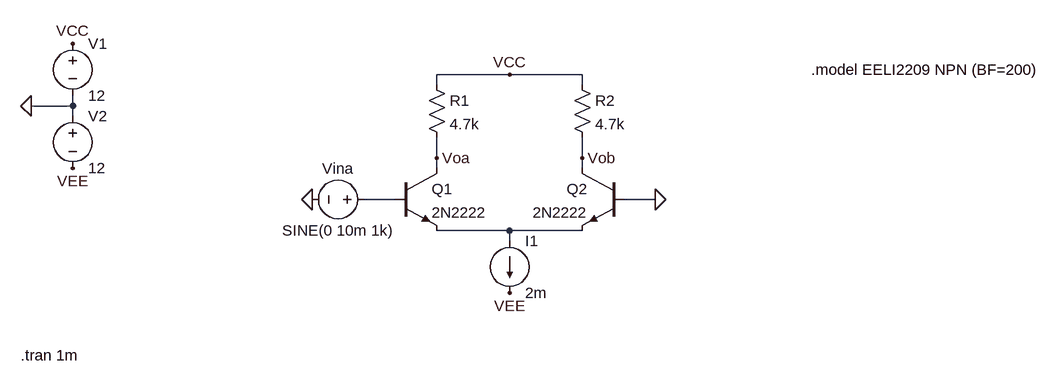
[diagram p0: schematic Draft2.asc]
Draft2.asc, the LTspice schematic file:
Version 4
SHEET 1 1432 680
WIRE 592 112 480 112
WIRE 704 112 592 112
WIRE 480 128 480 112
WIRE 704 128 704 112
WIRE -80 160 -80 144
WIRE -80 160 -144 160
WIRE -80 176 -80 160
WIRE 480 240 480 208
WIRE 704 240 704 208
WIRE 480 256 480 240
WIRE 704 256 704 240
WIRE 416 304 368 304
WIRE 816 304 768 304
WIRE 592 352 480 352
WIRE 704 352 592 352
WIRE 592 368 592 352
FLAG -80 256 VEE
FLAG -80 64 VCC
FLAG -144 160 0
FLAG 592 448 VEE
FLAG 592 112 VCC
FLAG 288 304 0
FLAG 704 240 Vob
FLAG 480 240 Voa
FLAG 816 304 0
SYMBOL voltage -80 48 R0
WINDOW 123 0 0 Left 0
WINDOW 39 0 0 Left 0
SYMATTR InstName V1
SYMATTR Value 12
SYMBOL voltage -80 160 R0
WINDOW 123 0 0 Left 0
WINDOW 39 0 0 Left 0
SYMATTR InstName V2
SYMATTR Value 12
SYMBOL npn 416 256 R0
SYMATTR InstName Q1
SYMATTR Value 2N2222
SYMBOL npn 768 256 M0
SYMATTR InstName Q2
SYMATTR Value 2N2222
SYMBOL res 464 112 R0
SYMATTR InstName R1
SYMATTR Value 4.7k
SYMBOL res 688 112 R0
SYMATTR InstName R2
SYMATTR Value 4.7k
SYMBOL current 592 368 R0
WINDOW 123 0 0 Left 0
WINDOW 39 0 0 Left 0
SYMATTR InstName I1
SYMATTR Value 2m
SYMBOL voltage 384 304 R90
WINDOW 0 -32 56 VBottom 2
WINDOW 3 32 56 VTop 2
WINDOW 123 0 0 Left 0
WINDOW 39 0 0 Left 0
SYMATTR InstName Vina
SYMATTR Value SINE(0 10m 1k)
TEXT -160 544 Left 2 !.tran 1m
TEXT 1056 104 Left 2 !.model EELI2209 NPN (BF=200)

The netlist it stands for:
* Draft2.asc
V1 VCC 0 12
V2 0 VEE 12
Q1 Voa N001 N002 0 2N2222
Q2 Vob 0 N002 0 2N2222
R1 VCC Voa 4.7k
R2 VCC Vob 4.7k
I1 N002 VEE 2m
Vina N001 0 SINE(0 10m 1k)
.model NPN NPN
.model PNP PNP
.lib standard.bjt
.tran 1m
.model EELI2209 NPN (BF=200)
.backanno
.end